# Altium schematic sheet iSystem-boards.SchDoc
size A4; SheetNumber: 7; SheetTotal: 8
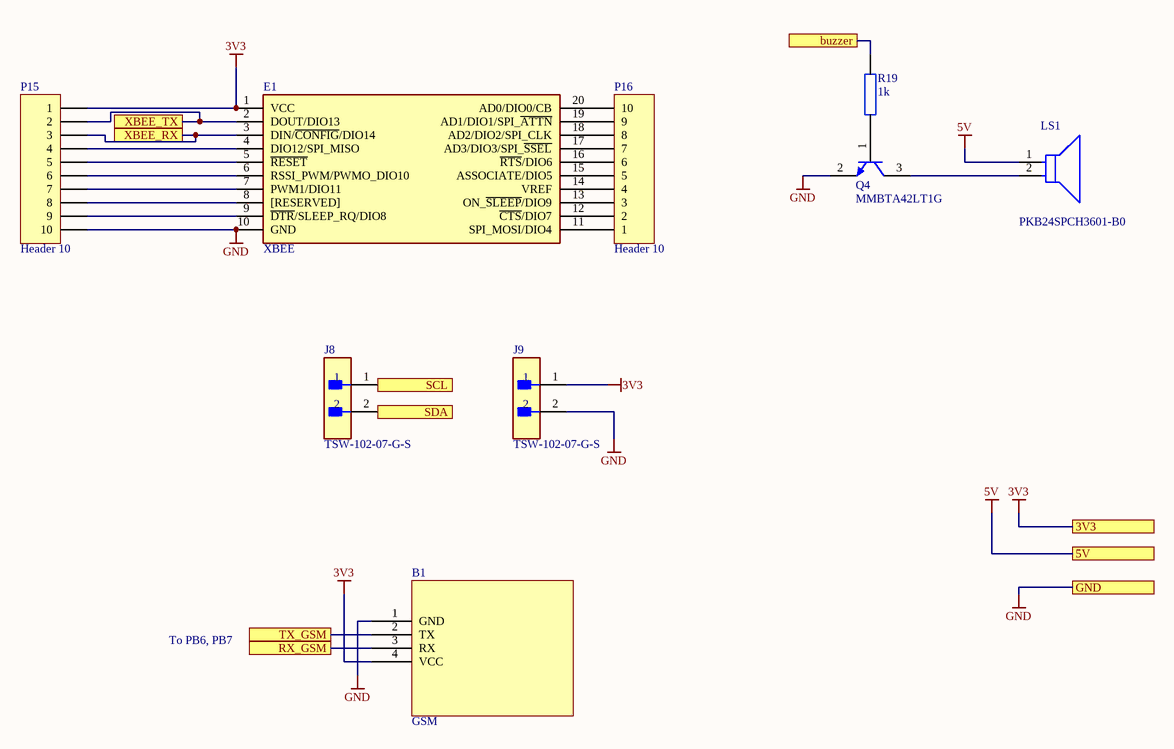
[diagram p0: iSystem-boards.SchDoc]

## Parts
B1  GSM  [GSM]
E1  XBEE  [XBEE]
J8  TSW-102-07-G-S  [FP-TSW-102-07-G-S-MFG]
J9  TSW-102-07-G-S  [FP-TSW-102-07-G-S-MFG]
LS1  PKB24SPCH3601-B0  [FP-PKB24SPCH3601-B0-MFG]
P15  Header 10  [HDR1X10]
P16  Header 10  [HDR1X10]
Q4  MMBTA42LT1G  [ONSC-SOT-23-3-318-08_V]
R19  1k  [0603]

## Ports
3V3, 5V, buzzer, GND, RX_GSM, SCL, SDA, TX_GSM, XBEE_RX, XBEE_TX

## Nets
3V3: B1.4(VCC) E1.1(VCC) J9.1 P15.1 ; port 3V3
5V: LS1.1(C) ; port 5V
GND: B1.1(GND) E1.10(GND) J9.2 P15.10 Q4.2(E) ; port GND
buzzer: R19.2 ; port buzzer
RX_GSM: B1.3(RX) ; port RX_GSM
SCL: J8.1 ; port SCL
SDA: J8.2 ; port SDA
TX_GSM: B1.2(TX) ; port TX_GSM
XBEE_RX: E1.3(DIN/~{CONFIG}/DIO14) P15.3 ; port XBEE_RX
XBEE_TX: E1.2(DOUT/DIO13) P15.2 ; port XBEE_TX
NetE1_4: E1.4(DIO12/SPI_MISO) P15.4
NetE1_5: E1.5(~{RESET}) P15.5
NetE1_6: E1.6(RSSI_PWM/PWMO_DIO10) P15.6
NetE1_7: E1.7(PWM1/DIO11) P15.7
NetE1_8: E1.8([RESERVED]) P15.8
NetE1_9: E1.9(~{DTR}/SLEEP_RQ/DIO8) P15.9
NetE1_11: E1.11(SPI_MOSI/DIO4) P16.1
NetE1_12: E1.12(~{CTS}/DIO7) P16.2
NetE1_13: E1.13(ON_~{SLEEP}/DIO9) P16.3
NetE1_14: E1.14(VREF) P16.4
NetE1_15: E1.15(ASSOCIATE/DIO5) P16.5
NetE1_16: E1.16(~{RTS}/DIO6) P16.6
NetE1_17: E1.17(AD3/DIO3/SPI_~{SSEL}) P16.7
NetE1_18: E1.18(AD2/DIO2/SPI_CLK) P16.8
NetE1_19: E1.19(AD1/DIO1/SPI_~{ATTN}) P16.9
NetE1_20: E1.20(AD0/DIO0/CB) P16.10
NetLS1_2: LS1.2(A) Q4.3(C)
NetQ4_1: Q4.1(B) R19.1

## Notes on the sheet
- To PB6, PB7

## Library data of the parts
B1 = GSM: 3V3
J8 J9 = CMP-02766-000084-1: CONN HEADER VERT 2POS 2.54MM; Manufacturer: Samtec; Number Of Contacts: 2; Voltage Rating: 550V; Conn Orientation: Straight; Current Rating: 6.3A; Conn Gender: Male; Package: TSW-102-07-G-S; Digikey Description: CONN HEADER VERT 2POS 2.54MM; ComponentLink2URL: http://suddendocs.samtec.com/catalog_english/tsw_th.pdf; Height: 8.71mm; Temperature: -55°C to +125°C; Device Class L2: Headers and Wire Housings; ComponentLink2Description: Datasheet; Device Class L3: unset; Contact Material: Gold,Nickel; Temperature Range Low: -55°C; Temperature Range High: +125°C; RoHS: TRUE; Device Class L1: Connectors; Mouser Description: Conn Unshrouded Header HDR 2 POS 2.54mm Solder ST Thru-Hole Automotive Bulk; Number Of Rows: 1; Category: Conn; Pitch: 2.54mm; Lead Free: Yes; Automotive: No; Manufacturer Part Number: TSW-102-07-G-S; Footprint Url: http://suddendocs.samtec.com/prints/tsw-xxx-xx-x-x-xx-xxx-footprint.pdf; Octopart: https://octopart.com/tsw-102-07-g-s-samtec-272197
LS1 = CMP-06203-000001-2: AUDIO PIEZO TRANSDUCER 3-15V TH; Self Resonant Frequency: 3.6kHz; Voltage Rating (DC): 15V; Min Supply Voltage: 3V; Operating Supply Current: 16mA; Voltage Rating: 12V; Max Frequency: 4.1kHz; Washable: No; REACH SVHC: No SVHC; Packaging: Bulk; Frequency: 3.6kHz; Max Operating Temperature: 70°C; Max Supply Voltage: 15V; Max Supply Voltage (DC): 15V; Diameter: 24.3mm; Lead Free: Lead Free; Radiation Hardening: No; Nominal Supply Current: 16mA; Height: 9.7mm; Mount: Flush; Nominal Supply Voltage (DC): 12V; Min Operating Temperature: -20°C; Termination: PC Pins; Length: 24.3mm; Package Quantity: 650; Min Supply Voltage (DC): 3V; Max Supply Current: 16mA
P15 P16 = Header 10: Header, 10-Pin; LatestRevisionDate: 17-Jul-2002; LatestRevisionNote: Re-released for DXP Platform.; Publisher: Altium Limited
Q4 = CMP-1048-00662-1: High Voltage Transistor, NPN Silicon, 3-Pin SOT-23, Pb-Free, Tape and Reel; Manufacturer: On Semiconductor; fT Min (MHz): 50; IC Continuous (A): 0.5; ComponentLink1URL: http://www.onsemi.com/; ComponentLink3URL: http://www.onsemi.cn/pub_link/Collateral/318-08.PDF; RoHS: TRUE; ComponentLink2Description: Datasheet; PartNumber: MMBTA42LT1G; Polarity: NPN; DatasheetVersion: Rev. 12; PackageReference: SOT-23-3-318-08; PackageDescription: 3-Pin Small Outline Transistor, Body 2.92 x 1.3 mm, Pitch 0.95 mm; ComponentLink3Description: Package Specification; ComponentLink1Description: Manufacturer URL; Packing: Tape and Reel; PackageVersion: Rev. AP, 11/2009; Mounting Technology: Surface Mount; ComponentLink2URL: http://www.onsemi.cn/pub_link/Collateral/MMBTA42LT1-D.PDF
R19 = Resistor: Value: ?